# Altium schematic sheet Input.SchDoc: <Project Name>
size A3; ApprovedBy: <Appr.>; Author: <Author>; CompanyName: Infineon Technologies AG; Engineer: <Rel.>; Organization: Infineon Technologies AG; Address1: IFAG DES S PS; Address2: Am Campeon 1-12  -  85579 Neubiberg  -  Germany; Address3: 85579 Neubiberg; Address4: Germany; DocumentNumber: 3; Revision: <Rev.>; SheetNumber: 3; SheetTotal: 9; Release: RC00; PageSetup: Record=PageOptions|CenterHorizontal=True|CenterVertical=True|PrintScale=1.01|XCorrection=1.00|YCorrection=1.00|PrintKind=0|BorderSize=5000000|LeftOffset=0|BottomOffset=0|Orientation=2|PaperLength=1000|PaperWidth=1000|Scale=100|PaperSource=7|PrintQuality=-4|MediaType=1|DitherType=10|PaperKind=A3|PrintScaleMode=1; Doc_ConfidentialStatus: <Doc_ConfidentialStatus>; Doc_Preliminary: <Doc_Preliminary>
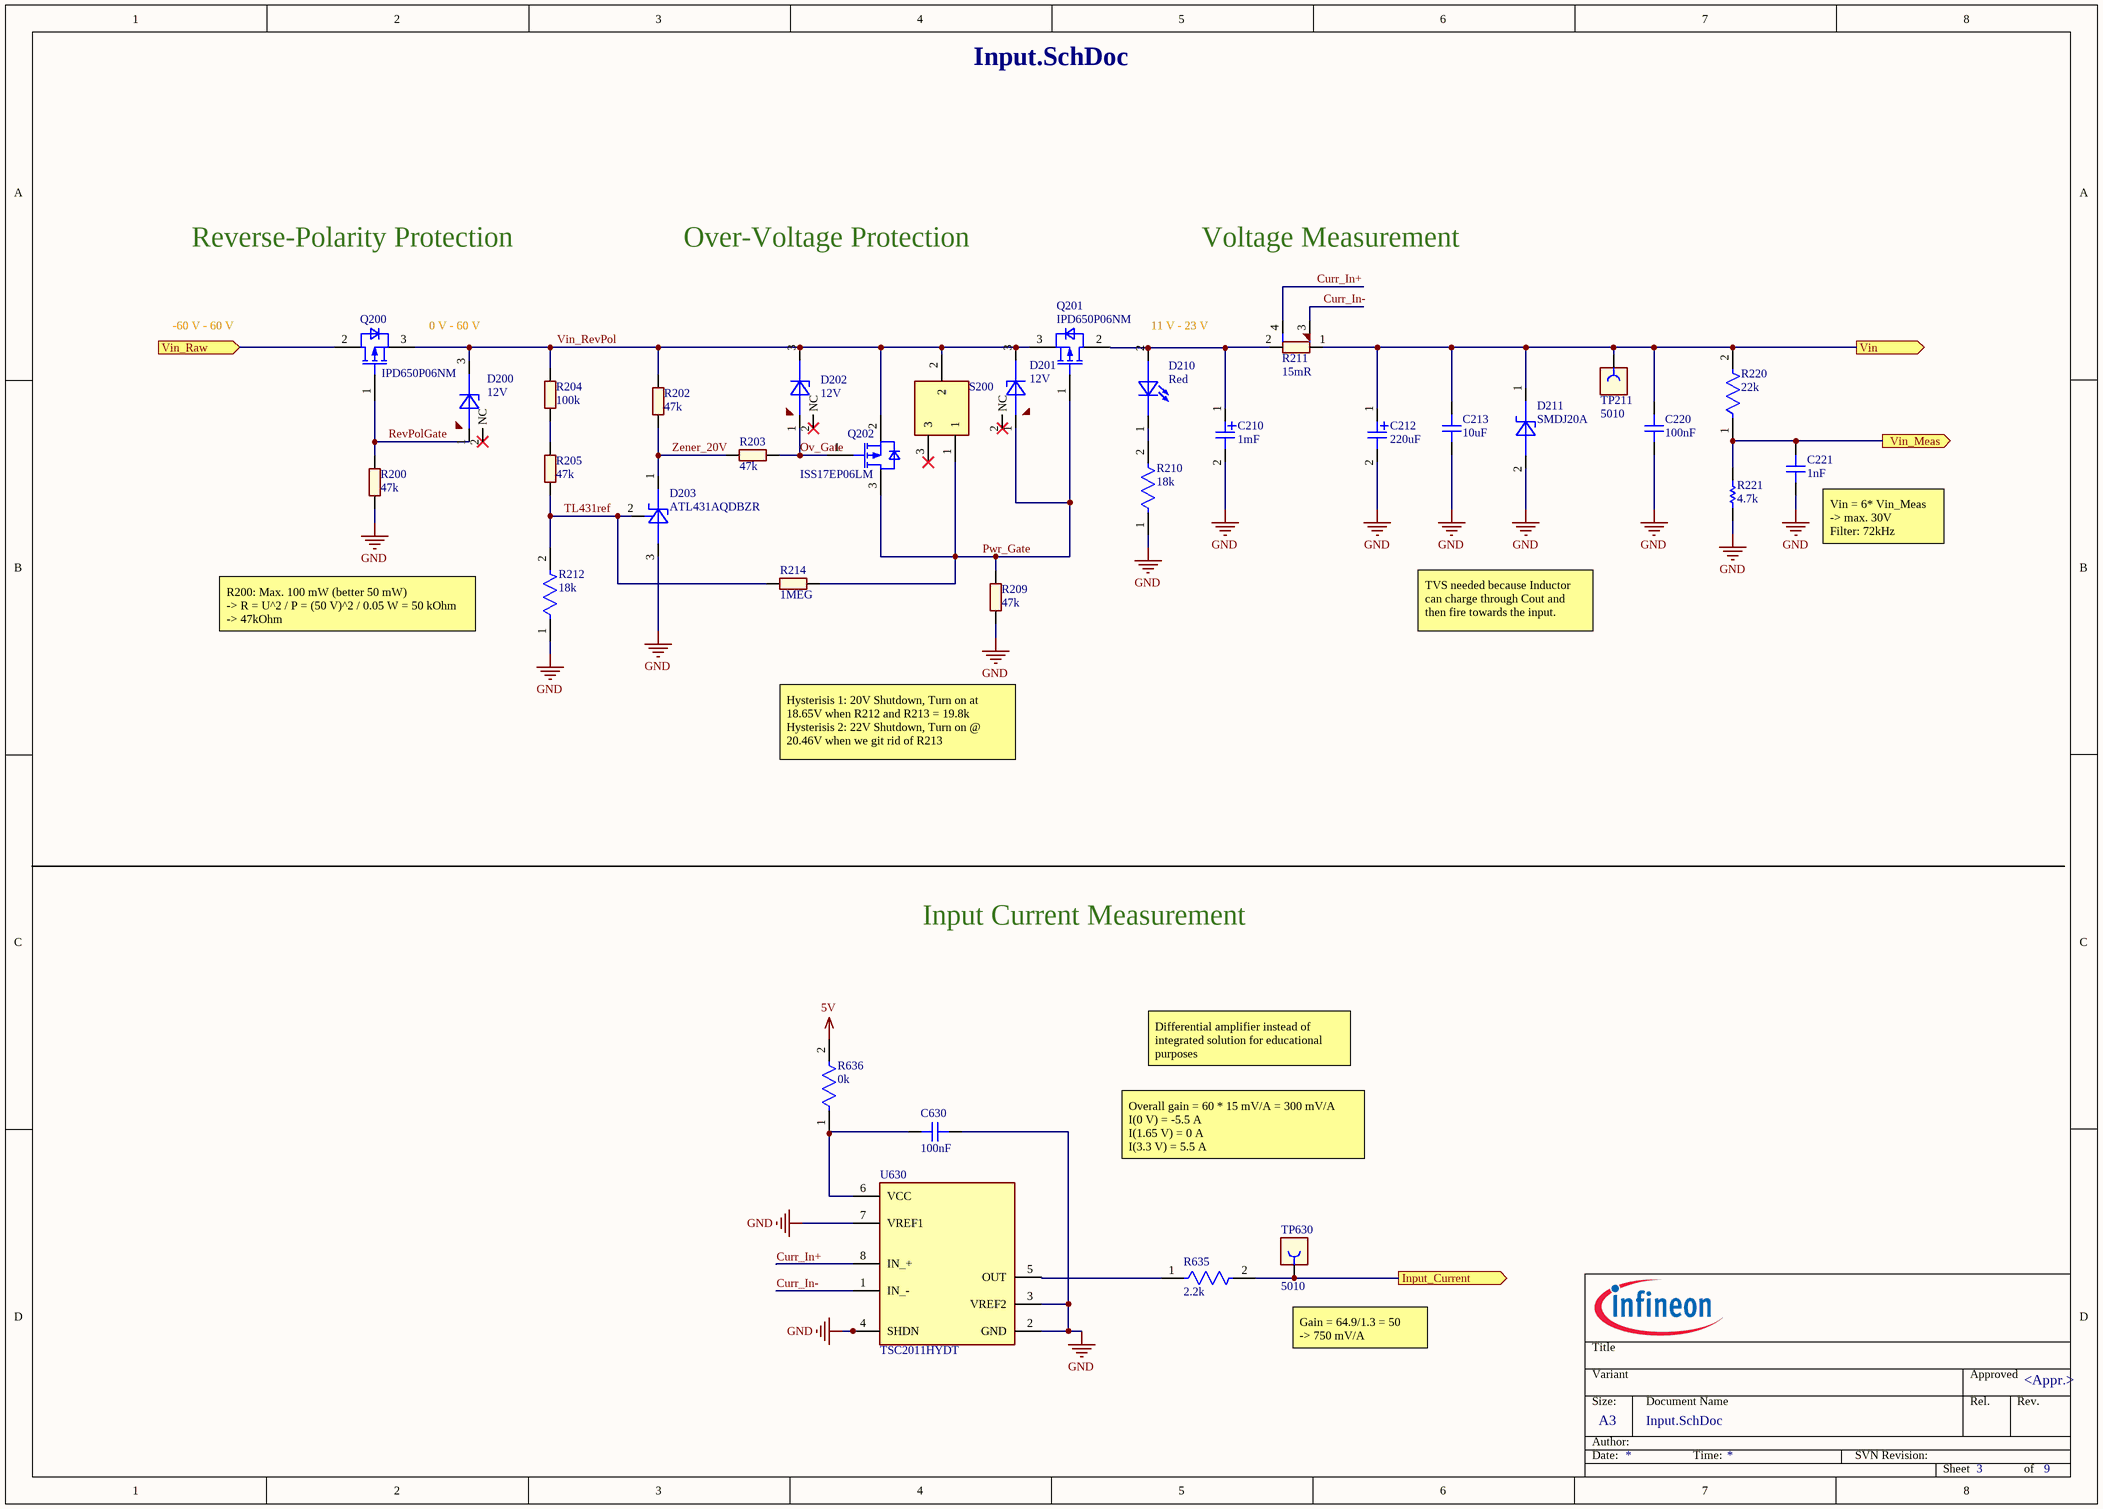
[diagram p0: Input.SchDoc]

## Parts
C210  1mF  [CAPPRD500W60D1300H2700B]
C212  220uF  [CAPAE1030X1050N-3]
C213  10uF  [CAPC3216X190N-1]
C220  100nF  [CAPC3216X125N-0]
C221  1nF  [CAPC3216X95N]
C630  100nF  [CAPC3216X125N-0]
D200  12V  [SOT95P230X110-3N]
D201  12V  [SOT95P230X110-3N]
D202  12V  [SOT95P230X110-3N]
D203  ATL431AQDBZR  [SOT95P237X112-3N-1]
D210  Red  [LEDSC160X80X80-2N-1]
D211  SMDJ20A  [DIOM7959X262N]
Q200  IPD650P06NM  [TO228P998X250-3N-V2]
Q201  IPD650P06NM  [TO228P998X250-3N-V2]
Q202  ISS17EP06LM  [SOT95P240X110-3N-1-V]
R200  47k  [RESC3216X60N]
R202  47k  [RESC3216X60N]
R203  47k  [RESC3216X60N]
R204  100k  [RESC3216X60N]
R205  47k  [RESC3216X60N]
R209  47k  [RESC3216X60N]
R210  18k  [FP-CRCW1206-e3-IPC_C]
R211  15mR  [RES-SMD-L4T12]
R212  18k  [FP-CRCW1206-e3-IPC_C]
R214  1MEG  [RESC3216X60N]
R220  22k  [FP-CRCW1206-e3-IPC_A]
R221  4.7k  [RESC3216X60X45ML15T20]
R635  2.2k  [FP-CRCW1206-e3-IPC_C]
R636  0k  [FP-CRCW1206-e3-IPC_C]
S200  500SSP1S2M2QEA  [500SSP1S2M2QEA]  (value not drawn)
TP211  5010  [CON-THT-TP-5010]
TP630  5010  [CON-THT-TP-5010]
U630  TSC2011HYDT  [SOIC127P600X175-8N]

## Ports
Input_Current (out), Vin (out), Vin_Meas (out), Vin_Raw (in)

## Nets
5V: R636.2
GND: C210.2 C212.2 C213.1 C220.2 C221.1 C630.1 D203.3(ANODE) D211.2(ANODE) R200.1 R209.1 R210.1 R212.1 R221.1 U630.2(GND) U630.3(VREF2) U630.4(SHDN) U630.7(VREF1)
Curr_In+: R211.4(I2) U630.8(IN_+)
Curr_In-: R211.3(I1) U630.1(IN_-)
Input_Current: R635.2 TP630.1 ; port Input_Current
Ov_Gate: D202.1(ANODE) Q202.1(GATE) R203.1
Pwr_Gate: D201.1(ANODE) Q201.1(GATE) Q202.3(DRAIN) R209.2 R214.2 S200.1
RevPolGate: D200.1(ANODE) Q200.1(GATE) R200.2
TL431ref: D203.2(REF) R205.1 R212.2 R214.1
Vin: C212.1 C213.2 C220.1 D211.1(CATHODE) R211.1(V1) R220.2 TP211.1 ; port Vin
Vin_Meas: C221.2 R220.1 R221.2 ; port Vin_Meas
Vin_Raw: Q200.2(DRAIN) ; port Vin_Raw
Vin_RevPol: D200.3(CATHODE) D201.3(CATHODE) D202.3(CATHODE) Q200.3(SOURCE) Q201.3(SOURCE) Q202.2(SOURCE) R202.2 R204.1 S200.2
Zener_20V: D203.1(CATHODE) R202.1 R203.2
NetC210_1: C210.1 D210.2(Anode) Q201.2(DRAIN) R211.2(V2)
NetC630_2: C630.2 R636.1 U630.6(VCC)
NetD210_1: D210.1(Cathode) R210.2
NetR204_2: R204.2 R205.2
NetR635_1: R635.1 U630.5(OUT)

Not connected (* = marked no-connect by the designer): D200 2(NC)*; D201 2(NC)*; D202 2(NC)*; S200 3*

## Notes on the sheet
- Reverse-Polarity Protection
- Over-Voltage Protection
- Voltage Measurement
- -60 V - 60 V
- 0 V - 60 V
- (near D210) 11 V - 23 V
- (near C221) Vin = 6* Vin_Meas
  -> max. 30V
  Filter: 72kHz
- R200: Max. 100 mW (better 50 mW)
  -> R = U^2 / P = (50 V)^2 / 0.05 W = 50 kOhm
  -> 47kOhm
- TVS needed because Inductor can charge through Cout and then fire towards the input.
- Hysterisis 1: 20V Shutdown, Turn on at 18.65V when R212 and R213 = 19.8k
  Hysterisis 2: 22V Shutdown, Turn on @ 20.46V when we git rid of R213
- Input Current Measurement
- Differential amplifier instead of integrated solution for educational purposes
- Overall gain = 60 * 15 mV/A = 300 mV/A
  I(0 V) = -5.5 A
  I(1.65 V) = 0 A
  I(3.3 V) = 5.5 A
- (near TP630) Gain = 64.9/1.3 = 50
  -> 750 mV/A
- Title
- Variant
- Approved
- Date:
- Author:
- Size:
- A3
- Document Name
- Time:
- SVN Revision:
- Rel.
- Rev.
- Sheet
- of

## Library data of the parts
C210 = 646789: CAP / ELCO / 1mF / 35V / 20% / Aluminiumelectrolytic / -40°C to 105°C / 5.00mm C X 0.60mm W 13.00mm Dia X 27.00mm H / - / -; Multible Parts: No; Manufacturer: Kemet; Manufacturer Order Number: ESY108M035AL4AA; Symbol Type: Capacitor; Single; Polarized; 2 Pins; Pin 1 Positive; Alternate View: Yes; Article Number: 646789; Version Number: V01; Combined Parameters: TC:Aluminiumelectrolytic;Tol.:-20%/+20%;Vdc:35V; QuickPick: 1mF / 35V / 20% / Aluminiumelectrolytic / Radial; Type: Polarized; Style: Single; ComponentStatus: Released; PLMStatus: Active; Part Type: Capacitor; Value: 1mF; Tolerance Neg: 20%; Tolerance Pos: 20%; Application: Standard; Technology: Electrolytic; Temperature min: -40; Temperature max: 105; Temperature Range: Industrial; ROHS Compliant: Y; Automotive Qualified: No; PackageReference: Radial; ComponentLink1Description: Vendor WebSite; ComponentLink1URL: http://www.kemet.com; ComponentLink2Description: Datasheet; ComponentLink2URL: http://webnetprod.muc.infineon.com/PCBPortal_Prod/WorkFlows/AltiumComponent/StandardDocumentation?Versionid=646790; Supplier 1: Farnell; Supplier Part Number 1: 2835188; Supplier 2: DigiKey; Supplier Part Number 2: 399-6120-ND; Supplier 3: Mouser; Supplier Part Number 3: 80-ESY108M035AL4AA; Second Source allowed: Yes; Voltage DC (max): 35V; Package Description: Capacitor,polarized,Radial;5.00mm C X 0.60mm W 13.00mm Dia X 27.00mm H; MPN: ESY108M035AL4AA
C212 = 699376: CAP / ELCO / 220uF / 50V / 20% / Aluminiumelectrolytic / -55°C to 105°C / 10.30mm L X 10.30mm W X 10.50mm H / - / -; Multible Parts: No; Manufacturer: Nippon Chemi-Con; Manufacturer Order Number: EMZL500ARA221MJA0G; Symbol Type: Capacitor; Single; Polarized; 2 Pins; Pin 1 Positive; Alternate View: Yes; Article Number: 699376; Version Number: V00; Combined Parameters: TC:Aluminiumelectrolytic;Tol.:-20%/+20%;Vdc:50V; QuickPick: 220uF / 50V / 20% / Aluminiumelectrolytic / EMZL500ARA221MJA0G; Type: Polarized; Style: Single; Automotive Qualified: AEC Q200; ComponentStatus: Released; PLMStatus: Active; Part Type: Capacitor; Value: 220uF; Tolerance Neg: 20%; Tolerance Pos: 20%; Application: Standard; Technology: Electrolytic; Temperature min: -55; Temperature max: 105; Temperature Range: Military; ROHS Compliant: Y; PackageReference: EMZL500ARA221MJA0G; ComponentLink1Description: Vendor WebSite; ComponentLink1URL: http://www.chemi-con.co.jp/e/; ComponentLink2Description: Datasheet; ComponentLink2URL: http://webnetprod.muc.infineon.com/PCBPortal_Prod/WorkFlows/AltiumComponent/StandardDocumentation?Versionid=699377; Supplier 1: Farnell; Supplier 2: DigiKey; Supplier 3: Mouser; Supplier Part Number 3: 661-EMZL500ARA221MJA; Second Source allowed: Yes; Voltage DC (max): 50V; Package Description: Capacitor,Aluminum Electrolytic;10.30mm L X 10.30mm W X 10.50mm H; LCSC Part #: C6845235; MPN: EMZL500ARA221MJA0G
C213 = 648992: CAP / CERA / 10uF / 50V / 20% / X5R (EIA) / -55°C to 85°C / 1206 (3216) / SMD / -; Multiple Parts: No; Manufacturer: Taiyo Yuden; Manufacturer Order Number: C97712; MPN: UMK316BBJ106ML-T; Symbol Type: Capacitor; Single; Standard; 2 Pins; Alternate View: Yes; Article Number: 648992; Version Number: V00; Combined Parameters: TC:X5R (EIA);Tol.:-20%/+20%;Vdc:50V; QuickPick: 10uF / 50V / 20% / X5R (EIA) / 1206 (3216); Type: Standard; Style: Single; ComponentStatus: Released; PLMStatus: Active; Part Type: Capacitor; Value: 10uF; Tolerance Neg: 20%; Tolerance Pos: 20%; Application: Standard; Technology: Ceramic; Temperature min: -55; Temperature max: 85; Temperature Range: Military; ROHS Compliant: Y; Automotive Qualified: No; PackageReference: 1206 (3216); ComponentLink1Description: Vendor WebSite; ComponentLink1URL: http://www.yuden.co.jp/or/product/; ComponentLink2Description: Datasheet; ComponentLink2URL: http://webnetprod.muc.infineon.com/PCBPortal_Prod/WorkFlows/AltiumComponent/StandardDocumentation?Versionid=648993; Supplier 1: Farnell; Supplier Part Number 1: 2779059; Supplier 2: DigiKey; Supplier Part Number 2: 587-3248-1-ND; Supplier 3: Mouser; Supplier Part Number 3: 963-UMK316BBJ106ML-T; Second Source allowed: Yes; Voltage DC (max): 50V; Package Description: Capacitor,non-polarized,Chip;3.20mm L X 1.60mm W X 1.90mm H
C220 = 282874: CAP / CERA / 100nF / 50V / 10% / X7R (EIA) / -55°C to 125°C / 1206(3216) / SMD / -; Multiple Parts: No; Legacy PartNumber: CAP01005660; Manufacturer: MuRata; Manufacturer Order Number: GRM31MR71H104KA01; MPN: KAM31NR72A104KU; Symbol Type: Capacitor; Single; Standard; 2 Pins; Alternate View: Yes; Article Number: 282874; Version Number: V01; Combined Parameters: TC:X7R (EIA);Tol.:-10%/+10%;Vdc:50V; QuickPick: 100nF / 50V / 10% / X7R (EIA) / 1206 (3216); Type: Standard; Style: Single; Package Metric: 3216; Package Imperial: 1206; ComponentStatus: Released; PLMStatus: Obsolete; Legacy DeviceID: CAP01005660; Part Type: Capacitor; Value: 100nF; Tolerance Neg: 10%; Tolerance Pos: 10%; Application: Standard; Technology: Ceramic; Temperature min: -55; Temperature max: 125; Temperature Range: Military; ROHS Compliant: Y; Automotive Qualified: No; PackageReference: 1206 (3216); ComponentLink1Description: Vendor WebSite; ComponentLink1URL: http://www.murata.com/; ComponentLink2Description: Datasheet; ComponentLink2URL: http://webnetprod.muc.infineon.com/PCBPortal_Prod/WorkFlows/AltiumComponent/StandardDocumentation?Versionid=282875; Supplier 1: Farnell; Supplier 2: DigiKey; Supplier 3: Mouser; Second Source allowed: Yes; Voltage DC (max): 50V; Package Description: Capacitor,non-polarized,Chip;3.20mm L X 1.60mm W X 1.25mm H; LCSC Part #: C82601
C221 = 280698: CAP / CERA / 1nF / 50V / 10% / X7R (EIA) / -55°C to 125°C / 1206(3216) / SMD / -; Multiple Parts: No; Legacy PartNumber: CAP01005183; Manufacturer: MuRata; Manufacturer Order Number: GRM319R71H102KA01; MPN: C1206C102J1RACTU; Symbol Type: Capacitor; Single; Standard; 2 Pins; Alternate View: Yes; Article Number: 280698; Version Number: V01; Combined Parameters: TC:X7R (EIA);Tol.:-10%/+10%;Vdc:50V; QuickPick: 1nF / 50V / 10% / X7R (EIA) / 1206 (3216); Type: Standard; Style: Single; Package Metric: 3216; Package Imperial: 1206; ComponentStatus: Released; PLMStatus: Obsolete; Legacy DeviceID: CAP01005183; Part Type: Capacitor; Value: 1nF; Tolerance Neg: 10%; Tolerance Pos: 10%; Application: Standard; Technology: Ceramic; Temperature min: -55; Temperature max: 125; Temperature Range: Military; ROHS Compliant: Y; Automotive Qualified: No; PackageReference: 1206 (3216); ComponentLink1Description: Vendor WebSite; ComponentLink1URL: http://www.murata.com/; ComponentLink2Description: Datasheet; ComponentLink2URL: http://webnetprod.muc.infineon.com/PCBPortal_Prod/WorkFlows/AltiumComponent/StandardDocumentation?Versionid=280699; Supplier 1: Farnell; Supplier 2: DigiKey; Supplier 3: Mouser; Second Source allowed: Yes; Voltage DC (max): 50V; Package Description: Capacitor,non-polarized,Chip;3.20mm L X 1.60mm W X 0.95mm H; LCSC Part #: C440200
C630 = 282874: CAP / CERA / 100nF / 50V / 10% / X7R (EIA) / -55°C to 125°C / 1206(3216) / SMD / -; Multiple Parts: No; Legacy PartNumber: CAP01005660; Manufacturer: MuRata; Manufacturer Order Number: GRM31MR71H104KA01; Symbol Type: Capacitor; Single; Standard; 2 Pins; Alternate View: Yes; Article Number: 282874; Version Number: V01; Combined Parameters: TC:X7R (EIA);Tol.:-10%/+10%;Vdc:50V; QuickPick: 100nF / 50V / 10% / X7R (EIA) / 1206 (3216); Type: Standard; Style: Single; Package Metric: 3216; Package Imperial: 1206; ComponentStatus: Released; PLMStatus: Obsolete; Legacy DeviceID: CAP01005660; Part Type: Capacitor; Value: 100nF; Tolerance Neg: 10%; Tolerance Pos: 10%; Application: Standard; Technology: Ceramic; Temperature min: -55; Temperature max: 125; Temperature Range: Military; ROHS Compliant: Y; Automotive Qualified: No; PackageReference: 1206 (3216); ComponentLink1Description: Vendor WebSite; ComponentLink1URL: http://www.murata.com/; ComponentLink2Description: Datasheet; ComponentLink2URL: http://webnetprod.muc.infineon.com/PCBPortal_Prod/WorkFlows/AltiumComponent/StandardDocumentation?Versionid=282875; Supplier 1: Farnell; Supplier 2: DigiKey; Supplier 3: Mouser; Second Source allowed: Yes; Voltage DC (max): 50V; Package Description: Capacitor,non-polarized,Chip;3.20mm L X 1.60mm W X 1.25mm H
D200-D202 = 659605: Voltage regulator diodes; Multiple Parts: No; Manufacturer: Nexperia; Manufacturer Order Number: BZX84-C12,215; Symbol Type: Standard Zener Diode, 3 Pins, 1 Anode, 2 Not Connected, 3 Cathode; Alternate View: Yes; Article Number: 659605; Version Number: V00; Combined Parameters: Vf:900mV;If:10mA;Ur:8V;Ir:100nA;Pmax:250mW; QuickPick: Zener Diode / SOT-23; Type: Zener Diode; Style: Single; Automotive Qualified: AEC Q101; ComponentStatus: Released; PLMStatus: Active; Voltage DC (max): na; Part Type: Diode; Value: 12V; Application: Standard; Temperature min: -65; Temperature max: 150; Temperature Range: Military; ROHS Compliant: Y; PackageReference: SOT-23; ComponentLink1Description: Vendor WebSite; ComponentLink1URL: http://www.nexperia.com; ComponentLink2Description: Datasheet; ComponentLink2URL: http://webnetprod.muc.infineon.com/PCBPortal_Prod/WorkFlows/AltiumComponent/StandardDocumentation?Versionid=659606; Supplier 1: Farnell; Supplier Part Number 1: 1081407; Supplier 2: DigiKey; Supplier Part Number 2: 1727-2936-1-ND; Supplier 3: Mouser; Supplier Part Number 3: 771-BZX84-C12-T/R; Second Source allowed: Yes; Package Description: SOT,0.95mm,pitch;3 pin,1.30mm W X 2.90mm L X 1.10mm H body
  D200: LCSC Part #: C12773; MPN: BZX84-C12,215
D203 = 644060: ATL431 Adjustable Precision Shunt Regulator; Manufacturer: Texas Instruments; Symbol type: TVS Diode Symbol, 1 Cathode, 2 Reference , 3 Anode; Article Number: 644060; Version Number: V01; Legacy DeviceID: TI_ATL431AQDBZR; Combined Parameters: - -;Vdc min/max:-;Iout:-;Fmax:-; QuickPick: SOT23-3 (DBZ); Automotive Qualified: No; ComponentStatus: Released; PLMStatus: Active; Second Source allowed: Yes; Voltage DC (max): na; Part Type: Integrated Circuit; Manufacturer Order Number: ATL431AQDBZR; Value: ATL431AQDBZR; Temperature min: -40; Temperature max: 125; Temperature Range: Automotive; ROHS Compliant: Y; PackageReference: SOT23-3 (DBZ); ComponentLink1Description: Vendor WebSite; ComponentLink1URL: http://www.ti.com; ComponentLink2Description: Datasheet; ComponentLink2URL: http://webnetprod.muc.infineon.com/PCBPortal_Prod/WorkFlows/AltiumComponent/StandardDocumentation?Versionid=644061; Supplier 1: Farnell; Supplier 2: DigiKey; Supplier Part Number 2: 296-47201-1-ND; Supplier 3: Mouser; Supplier Part Number 3: 595-ATL431AQDBZR; Package Description: SOT,0.95mm pitch;3 pin,1.30mm W X 2.92mm L X 1.12mm H body; LCSC Part #: C92572; MPN: ATL431AQDBZR
D210 = 625459: WL-SMCW SMT Mono-color Chip LED Waterclear, Red,630nm; Manufacturer: Wurth Elektronik; Manufacturer Order Number: 150060RS75000; Symbol Type: Standard LED Symbol, 1 Cathode, 2 Anode; Article Number: 625459; Version Number: V01; Combined Parameters: Vf:2.4V;If:30mA;Ur:5V;Ir:10uA;Pmax:72mW; QuickPick: LED / 1608 (0603); Style: Single; Automotive Qualified: No; ComponentStatus: Released; PLMStatus: Active; Second Source allowed: Yes; Voltage DC (max): na; Part Type: Diode; Value: Red; Type: LED; Application: Standard; Temperature min: -40; Temperature max: 85; Temperature Range: Industrial; ROHS Compliant: Y; PackageReference: 1608 (0603); ComponentLink1Description: Vendor WebSite; ComponentLink1URL: http://www.we-online.com; ComponentLink2Description: Datasheet; ComponentLink2URL: http://webnetprod.muc.infineon.com/PCBPortal_Prod/WorkFlows/AltiumComponent/StandardDocumentation?Versionid=625460; Supplier 1: Farnell; Supplier Part Number 1: 2322071; Supplier 2: DigiKey; Supplier Part Number 2: 732-4978-1-ND; Supplier 3: Mouser; Supplier Part Number 3: 710-150060RS75000; Package Description: LED,Side Concave; 2 pin,1.60mm W X 0.80mm L X 0.80mm H; LCSC Part #: C3030991; MPN: 150060RS75000
D211 = 646382: TVS Diode, Low Profile Package, Built in Strain Relief, Glass Passivated Chip Junction; Manufacturer: Littelfuse; Symbol Type: Transient Voltage Suppressor Diode (TVS, TAZ), 1 Cathode, 2 Anode; Article Number: 646382; Version Number: V01; Combined Parameters: Vf:5V;If:-;Ur:20V;Ir:2uA;Pmax:6.5W; QuickPick: TVS Diode / DO-214AB; Style: Single; Automotive Qualified: No; ComponentStatus: Released; PLMStatus: Active; Second Source allowed: Yes; Voltage DC (max): na; Part Type: Diode; Manufacturer Order Number: SMDJ20A; Value: SMDJ20A; Type: TVS Diode; Application: Standard; Temperature min: -65; Temperature max: 150; Temperature Range: Military; ROHS Compliant: Y; PackageReference: DO-214AB; ComponentLink1Description: Vendor WebSite; ComponentLink1URL: http://www.littelfuse.com/; ComponentLink2Description: Datasheet; ComponentLink2URL: http://webnetprod.muc.infineon.com/PCBPortal_Prod/WorkFlows/AltiumComponent/StandardDocumentation?Versionid=646383; Supplier 1: Farnell; Supplier Part Number 1: 2777300; Supplier 2: DigiKey; Supplier Part Number 2: SMDJ20ACT-ND; Supplier 3: Mouser; Supplier Part Number 3: 576-SMDJ20A; Package Description: Diode,Molded Body;7.94mm L X 5.905mm W X 2.62mm H; LCSC Part #: C2990194; MPN: SMDJ20A
Q200 = 644075: OptiMOS Power Transistor, -60 V; Manufacturer: Infineon Technologies; MPN: IPD650P06NMATMA1; Symbol Type: Insulated-Gate Field-Effect Transistor (IGFET), P-Channel, Enhancement,  Body Diode, Pin 1 Gate, 2 Drain, 3 Source, 3 Pins; Article Number: 644075; Version Number: V01; Legacy DeviceID: IFX_IPD650P06NM; Combined Parameters: P-Channel Enhancement;Uds:-60V;Id:-22A;Rds:65R;P:83W; QuickPick: P-Channel Enhancement / 83W / -22A / -60V / PG-TO252-3-313; Type: P-Channel Enhancement; Style: Single; Automotive Qualified: No; ComponentStatus: Released; PLMStatus: Active; Second Source allowed: Yes; Voltage DC (max): na; Part Type: Transistor FET; Manufacturer Order Number: IPD650P06NM; Value: IPD650P06NM; Application: Power Electronics; Temperature min: -55; Temperature max: 175; Temperature Range: Military; ROHS Compliant: Y; PackageReference: PG-TO252-3-313; ComponentLink1Description: Vendor WebSite; ComponentLink1URL: https://www.infineon.com/; ComponentLink2Description: Datasheet; ComponentLink2URL: http://webnetprod.muc.infineon.com/PCBPortal_Prod/WorkFlows/AltiumComponent/StandardDocumentation?Versionid=644076; Supplier 1: Farnell; Supplier Part Number 1: 3267848; Supplier 2: DigiKey; Supplier Part Number 2: 448-IPD650P06NMATMA1CT-ND; Supplier 3: Mouser; Supplier Part Number 3: 726-IPD650P06NMATMA1; Package Description: TO,2.28mm pitch;2 pin,9.98mm L X 6.50mm W X 2.50mm H body
Q201 = 644075: OptiMOS Power Transistor, -60 V; Manufacturer: Infineon Technologies; Symbol Type: Insulated-Gate Field-Effect Transistor (IGFET), P-Channel, Enhancement,  Body Diode, Pin 1 Gate, 2 Drain, 3 Source, 3 Pins; Article Number: 644075; Version Number: V01; Legacy DeviceID: IFX_IPD650P06NM; Combined Parameters: P-Channel Enhancement;Uds:-60V;Id:-22A;Rds:65R;P:83W; QuickPick: P-Channel Enhancement / 83W / -22A / -60V / PG-TO252-3-313; Type: P-Channel Enhancement; Style: Single; Automotive Qualified: No; ComponentStatus: Released; PLMStatus: Active; Second Source allowed: Yes; Voltage DC (max): na; Part Type: Transistor FET; Manufacturer Order Number: IPD650P06NM; Value: IPD650P06NM; Application: Power Electronics; Temperature min: -55; Temperature max: 175; Temperature Range: Military; ROHS Compliant: Y; PackageReference: PG-TO252-3-313; ComponentLink1Description: Vendor WebSite; ComponentLink1URL: https://www.infineon.com/; ComponentLink2Description: Datasheet; ComponentLink2URL: http://webnetprod.muc.infineon.com/PCBPortal_Prod/WorkFlows/AltiumComponent/StandardDocumentation?Versionid=644076; Supplier 1: Farnell; Supplier Part Number 1: 3267848; Supplier 2: DigiKey; Supplier Part Number 2: 448-IPD650P06NMATMA1CT-ND; Supplier 3: Mouser; Supplier Part Number 3: 726-IPD650P06NMATMA1; Package Description: TO,2.28mm pitch;2 pin,9.98mm L X 6.50mm W X 2.50mm H body
Q202 = 615536: OptiMOSTM Small Signal Transistor, -60 V; Manufacturer: Infineon Technologies; MPN: ISS17EP06LMXTSA1; Symbol Type: Insulated-Gate Field-Effect Transistor (IGFET), P-Channel, Enhancement,  Body Diode, Pin 1 Gate, 2 Source, 3 Drain, 3 Pins; Article Number: 615536; Version Number: V01; Legacy DeviceID: IFX_ISS17EP06LM; Combined Parameters: P-Channel Enhancement;Uds:-60V;Id:-300mA;Rds:1.7R;P:360mW; QuickPick: P-Channel Enhancement / 360mW / -300mA / -60V / PG-SOT23-3-5; Type: P-Channel Enhancement; Style: Single; Automotive Qualified: No; ComponentStatus: Released; PLMStatus: Active; Second Source allowed: Yes; Voltage DC (max): na; Part Type: Transistor FET; Manufacturer Order Number: ISS17EP06LM; Value: ISS17EP06LM; Application: Small Signal; Temperature min: -55; Temperature max: 150; Temperature Range: Military; ROHS Compliant: Y; PackageReference: PG-SOT23-3-5; ComponentLink1Description: Vendor WebSite; ComponentLink1URL: https://www.infineon.com/; ComponentLink2Description: Datasheet; ComponentLink2URL: http://webnetprod.muc.infineon.com/PCBPortal_Prod/WorkFlows/AltiumComponent/StandardDocumentation?Versionid=615537; Supplier 1: Farnell; Supplier Part Number 1: 3267800; Supplier 2: DigiKey; Supplier Part Number 2: 448-ISS17EP06LMXTSA1CT-ND; Supplier 3: Mouser; Supplier Part Number 3: 726-ISS17EP06LMXTSA1; Package Description: SOT,0.95mm,pitch;3 pin,1.30mm W X 2.90mm L X 1.10mm H body
R200 R202 R203 R205 R209 = 354562: RES / STD / 47k / 250mW / 1% / 100ppm/K / -55°C to 155°C / 1206(3216) / SMD / -; Multiple Parts: No; Legacy PartNumber: RES01802933; Manufacturer: Vishay; Manufacturer Order Number: CRCW120647K0FK; Symbol Type: Resistor; Single; Standard; 2 Pins; Alternate View: Yes; Article Number: 354562; Version Number: V01; Combined Parameters: TCR:100ppm/K;Tol.:-1%/+1%;Vdc:200V;Idc:-;P:250mW; QuickPick: 47k / 1% / 0.25 / 1206 (3216); Style: Single; Automotive Qualified: AEC Q200; Package Metric: 3216; Package Imperial: 1206; ComponentStatus: Released; PLMStatus: Active; Voltage DC (max): 200V; Legacy DeviceID: RES01802933; Part Type: Resistor; Value: 47k; Tolerance Neg: 1%; Tolerance Pos: 1%; Type: Standard; Technology: Thick Film; Temperature min: -55; Temperature max: 155; Temperature Range: Military; ROHS Compliant: Y; PackageReference: 1206 (3216); ComponentLink1Description: Vendor WebSite; ComponentLink1URL: http://www.vishay.com; ComponentLink2Description: Datasheet; ComponentLink2URL: http://webnetprod.muc.infineon.com/PCBPortal_Prod/WorkFlows/AltiumComponent/StandardDocumentation?Versionid=354563; Supplier 1: Farnell; Supplier 2: DigiKey; Supplier 3: Mouser; Second Source allowed: Yes
R204 = 354752: RES / STD / 100k / 250mW / 1% / 100ppm/K / -55°C to 155°C / 1206(3216) / SMD / -; Multiple Parts: No; Legacy PartNumber: RES01802971; Manufacturer: Vishay; Manufacturer Order Number: CRCW1206100KFK; Symbol Type: Resistor; Single; Standard; 2 Pins; Alternate View: Yes; Article Number: 354752; Version Number: V01; Combined Parameters: TCR:100ppm/K;Tol.:-1%/+1%;Vdc:200V;Idc:-;P:250mW; QuickPick: 100k / 1% / 0.25 / 1206 (3216); Style: Single; Automotive Qualified: AEC Q200; Package Metric: 3216; Package Imperial: 1206; ComponentStatus: Released; PLMStatus: Active; Voltage DC (max): 200V; Legacy DeviceID: RES01802971; Part Type: Resistor; Value: 100k; Tolerance Neg: 1%; Tolerance Pos: 1%; Type: Standard; Technology: Thick Film; Temperature min: -55; Temperature max: 155; Temperature Range: Military; ROHS Compliant: Y; PackageReference: 1206 (3216); ComponentLink1Description: Vendor WebSite; ComponentLink1URL: http://www.vishay.com; ComponentLink2Description: Datasheet; ComponentLink2URL: http://webnetprod.muc.infineon.com/PCBPortal_Prod/WorkFlows/AltiumComponent/StandardDocumentation?Versionid=354753; Supplier 1: Farnell; Supplier 2: DigiKey; Supplier 3: Mouser; Second Source allowed: Yes
R210 = CMP-2003-01854-2: RES Thick Film, 18kΩ, 1%, 0.25W, 100ppm/°C, 1206; MPN: CRCW120618K0FKEA; Max Power Dissipation: 250mW; Voltage Rating: 200V; Resistance: 18kR; Radiation Hardening: No; Case Code (Imperial): 1206; Case/Package: 1206; Lead Free: Lead Free; Number of Terminations: 2; Case Code (Metric): 3216; Number of Pins: 2; Power Rating: 250mW; Length: 3.2mm; Width: 0.063inch; Features: Automotive AEC-Q200; Max Operating Temperature: 155°C; Tolerance: 1%; Termination: SMD/SMT; Military Standard: Not; Composition: Thick Film; Min Operating Temperature: -55°C; Temperature Coefficient: 100ppm/°C; Package Quantity: 10; Weight: 0.000353oz; Voltage Rating (DC): 200V; Depth: 1.6mm; Contact Plating: Tin; Height: 0.55mm; Packaging: Tape and Reel; Value: 18k
R211 = 644055: RES / STD / 15mR / 500mW / 1% / 75ppm/K / -55°C to 155°C / 1206 (3216) / SMD / -; Multiple Parts: No; Manufacturer: Ohmite; Manufacturer Order Number: L4T12FR015FER; Symbol Type: Resistor; 4-Terminal (Shunt); Standard; 4 Pins; Alternate View: Yes; Article Number: 644055; Version Number: V01; Combined Parameters: TCR:75ppm/K;Tol.:-1%/+1%;Vdc:-;Idc:-;P:500mW; QuickPick: 15mR / 1% / 0.5 / 1206 (3216); Style: 4-Terminal (Shunt); ComponentStatus: Released; PLMStatus: Active; Part Type: Resistor; Value: 15mR; Tolerance Neg: 1%; Tolerance Pos: 1%; Type: Standard; Application: Precision; Technology: Thick Film; Temperature min: -55; Temperature max: 155; Temperature Range: Military; ROHS Compliant: Y; Automotive Qualified: No; PackageReference: 1206 (3216); ComponentLink1Description: Vendor WebSite; ComponentLink1URL: http://www.ohmite.com; ComponentLink2Description: Datasheet; ComponentLink2URL: http://webnetprod.muc.infineon.com/PCBPortal_Prod/WorkFlows/AltiumComponent/StandardDocumentation?Versionid=644056; Supplier 1: Farnell; Supplier Part Number 1: 3274221; Supplier 2: DigiKey; Supplier Part Number 2: 273-L4T12FR015FERCT-ND; Supplier 3: Mouser; Supplier Part Number 3: 284-L4T12FR015FER; Second Source allowed: Yes; Package Description: Resistor, SMD, 4 pin, 3.00 mm L X 1.60 mm W X 0.65 mm H body; MPN: L4T12FR015FER
R212 = CMP-2003-01854-2: RES Thick Film, 18kΩ, 1%, 0.25W, 100ppm/°C, 1206; Max Power Dissipation: 250mW; Voltage Rating: 200V; Resistance: 18kR; Radiation Hardening: No; Case Code (Imperial): 1206; Case/Package: 1206; Lead Free: Lead Free; Number of Terminations: 2; Case Code (Metric): 3216; Number of Pins: 2; Power Rating: 250mW; Length: 3.2mm; Width: 0.063inch; Features: Automotive AEC-Q200; Max Operating Temperature: 155°C; Tolerance: 1%; Termination: SMD/SMT; Military Standard: Not; Composition: Thick Film; Min Operating Temperature: -55°C; Temperature Coefficient: 100ppm/°C; Package Quantity: 10; Weight: 0.000353oz; Voltage Rating (DC): 200V; Depth: 1.6mm; Contact Plating: Tin; Height: 0.55mm; Packaging: Tape and Reel; Value: 18k
R214 = 355322: RES / STD / 1MEG / 250mW / 1% / 100ppm/K / -55°C to 155°C / 1206(3216) / SMD / -; Multiple Parts: No; Legacy PartNumber: RES01803085; Manufacturer: Vishay; Manufacturer Order Number: CRCW12061M00FK; MPN: CRCW12061M00FKEA; Symbol Type: Resistor; Single; Standard; 2 Pins; Alternate View: Yes; Article Number: 355322; Version Number: V01; Combined Parameters: TCR:100ppm/K;Tol.:-1%/+1%;Vdc:200V;Idc:-;P:250mW; QuickPick: 1MEG / 1% / 0.25 / 1206 (3216); Style: Single; Automotive Qualified: AEC Q200; Package Metric: 3216; Package Imperial: 1206; ComponentStatus: Released; PLMStatus: Active; Voltage DC (max): 200V; Legacy DeviceID: RES01803085; Part Type: Resistor; Value: 1MEG; Tolerance Neg: 1%; Tolerance Pos: 1%; Type: Standard; Technology: Thick Film; Temperature min: -55; Temperature max: 155; Temperature Range: Military; ROHS Compliant: Y; PackageReference: 1206 (3216); ComponentLink1Description: Vendor WebSite; ComponentLink1URL: http://www.vishay.com; ComponentLink2Description: Datasheet; ComponentLink2URL: http://webnetprod.muc.infineon.com/PCBPortal_Prod/WorkFlows/AltiumComponent/StandardDocumentation?Versionid=355323; Supplier 1: Farnell; Supplier 2: DigiKey; Supplier 3: Mouser; Second Source allowed: Yes; LCSC Part #: C108083
R220 = CMP-2003-01962-2: RES Thick Film, 22kΩ, 1%, 0.25W, 100ppm/°C, 1206; MPN: CRCW120622K0FKEA; Voltage Rating (DC): 200V; Max Power Dissipation: 250mW; Lead Free: Lead Free; Length: 3.2mm; Case Code (Imperial): 1206; Max Operating Temperature: 155°C; Value: 22k; Packaging: Tape and Reel; Composition: Thick Film; Temperature Coefficient: 100ppm/°C; Contact Plating: Tin; Number of Terminations: 2; Case Code (Metric): 3216; Tolerance: 1%; Weight: 0.000353oz; Features: Automotive AEC-Q200; Min Operating Temperature: -55°C; Width: 0.063inch; Package Quantity: 10; Case/Package: 1206; Termination: SMD/SMT; Military Standard: Not; Depth: 1.6mm; Voltage Rating: 200V; Radiation Hardening: No; Power Rating: 250mW; Height: 0.55mm; LCSC Part #: C844656
R221 = CMP-2100-03618-1: Chip Resistor, 4.7 KOhm, +/- 1%, 0.25 W, -55 to 155 degC, 1206 (3216 Metric), RoHS, Tape and Reel; Manufacturer: Vishay Semiconductor; MPN: CRCW12064K70FKEA; Power Rating: 250mW; Voltage Rating: 200V; Temperature Coefficient: 100ppm/degreesC; Package Quantity: 10; Composition: ThickFilm; REACH SVHC: Unknown; Mount: SurfaceMount; Max Operating Temperature: 155degC; Length: 3.2mm; Number of Terminations: 2; Case Code (Metric): 3216; Military Standard: Not; Width: 1.6mm; Datasheet Version: 41061.0; Max Power Dissipation: 250mW; Datasheet URL: http://www.vishay.com/docs/20035/dcrcwe3.pdf; Contact Plating: Tin; Case/Package: 1206; Height: 0.55mm; Package Reference: 1206.0; Lead Free: LeadFree; Weight: 0.000353oz; Package Description: 2-Pin Surface Mount Device, Body 3.15 x 1.6 mm; Min Operating Temperature: -55degC; Value: 4.7k; Packaging: TapeandReel; Depth: 1.6mm; Tolerance: 1%; RoHSCompliant: true; Termination: SMD/SMT; Case Code (Imperial): 1206; Voltage Rating (DC): 200V; Radiation Hardening: No; Manufacturer URL: http://www.vishay.com/; LCSC Part #: C137262
R635 = CMP-2003-02034-2: RES Thick Film, 2.2kΩ, 1%, 0.25W, 100ppm/°C, 1206; Voltage Rating: 200V; Max Power Dissipation: 250mW; Voltage Rating (DC): 200V; Depth: 1.6mm; Max Operating Temperature: 155°C; Width: 1.6mm; Packaging: Tape and Reel; Min Operating Temperature: -55°C; Military Standard: Not; Weight: 0.000353oz; Package Quantity: 10; Case Code (Metric): 3216; Length: 3.2mm; Lead Free: Lead Free; Case/Package: 1206; Number of Terminations: 2; Value: 2.2k; Temperature Coefficient: 100ppm/°C; Case Code (Imperial): 1206; Power Rating: 250mW; Contact Plating: Tin; Composition: Thick Film; Features: Automotive AEC-Q200; Termination: SMD/SMT; Height: 0.55mm; Tolerance: 1%; Radiation Hardening: No
R636 = CMP-2003-04857-2: RES Thick Film, 0Ω, 0.25W, 1206; Power Rating: 250mW; Temperature Coefficient: 100ppm/°C; Tolerance: 1%; Voltage Rating (DC): 200V; Width: 1.6mm; Termination: SMD/SMT; Contact Plating: Tin; Min Operating Temperature: -55°C; Military Standard: Not; Mount: Surface Mount; Case Code (Metric): 3216; Case Code (Imperial): 1206; Packaging: Tape and Reel; Depth: 1.6mm; Case/Package: 1206; Radiation Hardening: No; Value: 0k; Height: 0.55mm; Package Quantity: 5000; Weight: 0.000353oz; Max Operating Temperature: 155°C; Length: 3.2mm; Composition: Thick Film; Lead Free: Lead Free; Voltage Rating: 200V
S200 = 500SSP1S2M2QEA: Connector; Manufacturer_Name: E-Switch; Datasheet Link: https://configured-product-images.s3.amazonaws.com/2D/specs/500SSP1S2M2QEA.pdf; Height: 6.6mm; Manufacturer_Part_Number: 500SSP1S2M2QEA; Mouser Part Number: 612-500SSP1S2M2QEA; Mouser Price/Stock: https://www.mouser.co.uk/ProductDetail/E-Switch/500SSP1S2M2QEA?qs=f57gQzlyLipU%252BL4xPBemOw%3D%3D; Value: 500SSP1S2M2QEA
TP211 TP630 = 382400: PC Test Point-Multipurpose THT, Red; Multiple Parts: No; Legacy PartNumber: CON01500529; Manufacturer: Keystone Electronics Corp.; Symbol Type: Connector, 1 Lead, Female; Alternate View: Yes; Article Number: 382400; Version Number: V01; Legacy DeviceID: KEY_5010; Combined Parameters: Board-to-Cable None (onboard);1x1;Mounting:THT;Orient:0° (vertical);Shielded:No; QuickPick: 0° (vertical) / Board-to-Cable; Style: Not Applicable; ComponentStatus: Released; PLMStatus: Active; Voltage DC (max): na; Part Type: Connector; Manufacturer Order Number: 5010; Value: 5010; Type: Board-to-Cable; Application: Test; Temperature min: 0; Temperature max: 0; Temperature Range: Military; ROHS Compliant: Y; Automotive Qualified: No; ComponentLink1Description: Vendor WebSite; ComponentLink1URL: http://www.keyelco.com/; ComponentLink2Description: Datasheet; ComponentLink2URL: http://webnetprod.muc.infineon.com/PCBPortal_Prod/WorkFlows/AltiumComponent/StandardDocumentation?Versionid=382401; Supplier 1: Farnell; Supplier Part Number 1: 2301288; Supplier 2: DigiKey; Supplier Part Number 2: 36-5010-ND; Supplier 3: Mouser; Supplier Part Number 3: 534-5010; Second Source allowed: Yes; Package Description: Test Point, 1.78 mm Lead Width, Round, 3.17 mm Dia X 8.28 mm H body
U630 = TSC2011HYDT: Integrated Circuit; Manufacturer_Name: STMicroelectronics; Datasheet Link: https://www.st.com/resource/en/datasheet/tsc2010h.pdf; Height: 1.75mm; Manufacturer_Part_Number: TSC2011HYDT; Mouser Part Number: 511-TSC2011HYDT; Mouser Price/Stock: https://www.mouser.co.uk/ProductDetail/STMicroelectronics/TSC2011HYDT?qs=XAiT9M5g4x%2FISpfhIc7UDw%3D%3D; Arrow Part Number: TSC2011HYDT; Arrow Price/Stock: https://www.arrow.com/en/products/tsc2011hydt/stmicroelectronics?utm_currency=USD&region=nac; Value: TSC2011HYDT; MPN: TSC2011HYDT